# EAGLE design untitled (EAGLE 9.6.2)
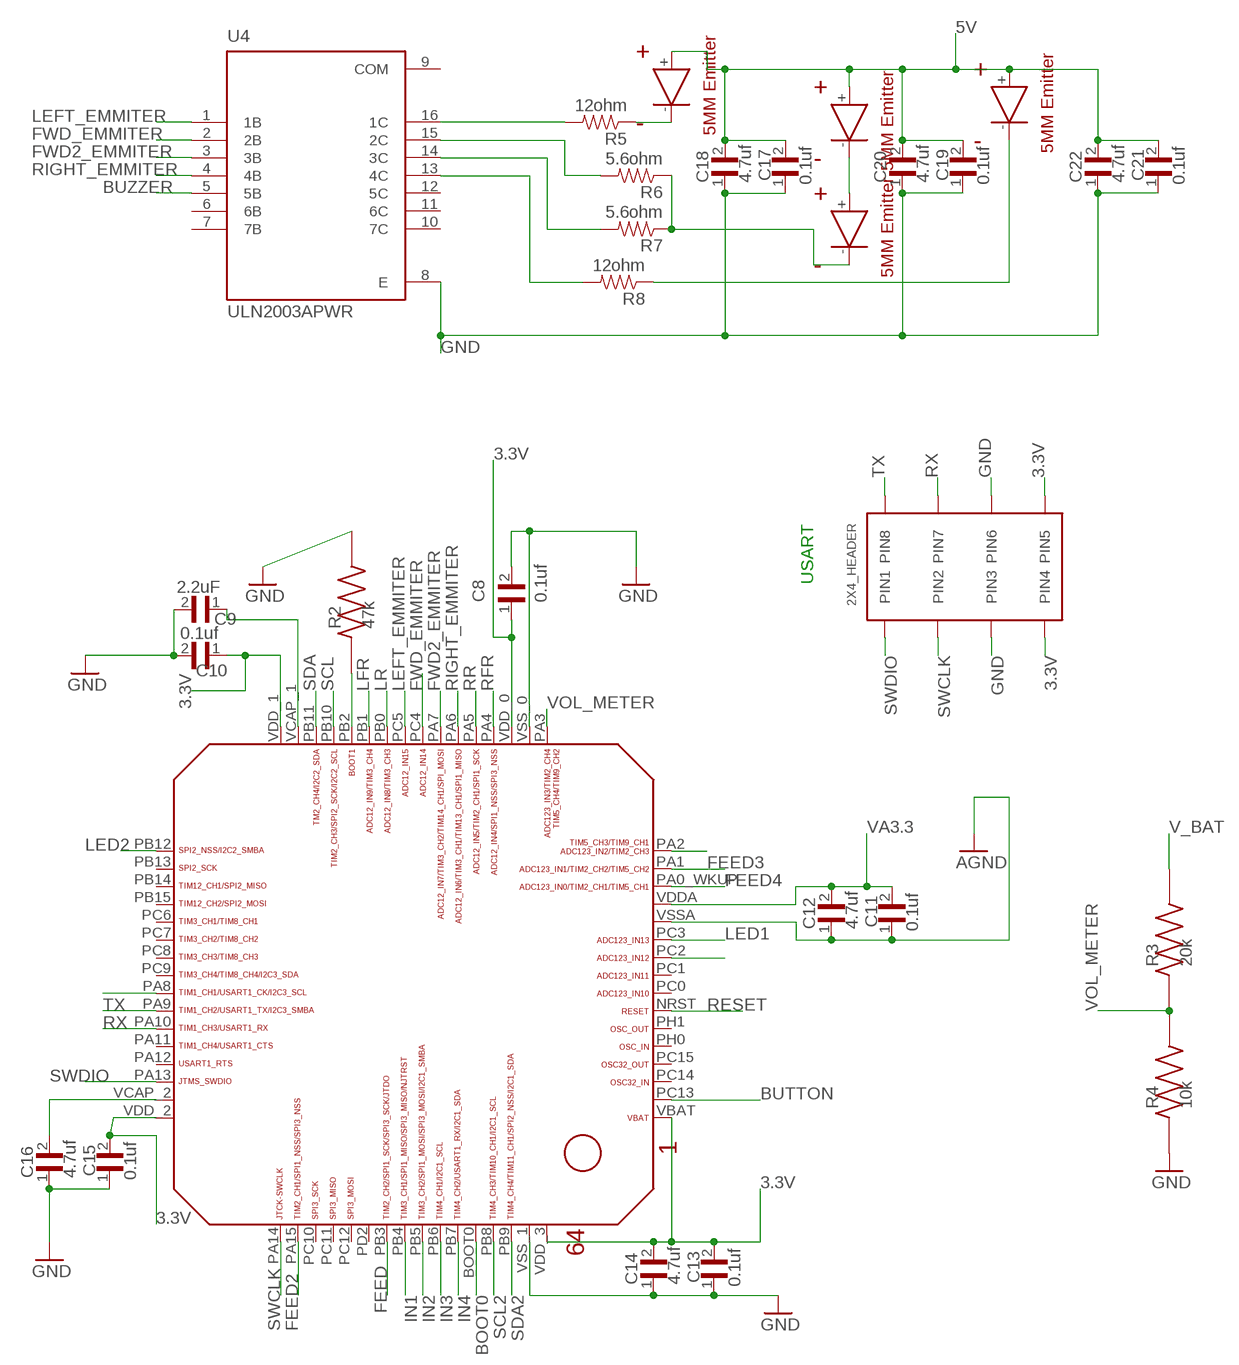
[diagram p0: schematic, sheet 1, part 1 of 2]
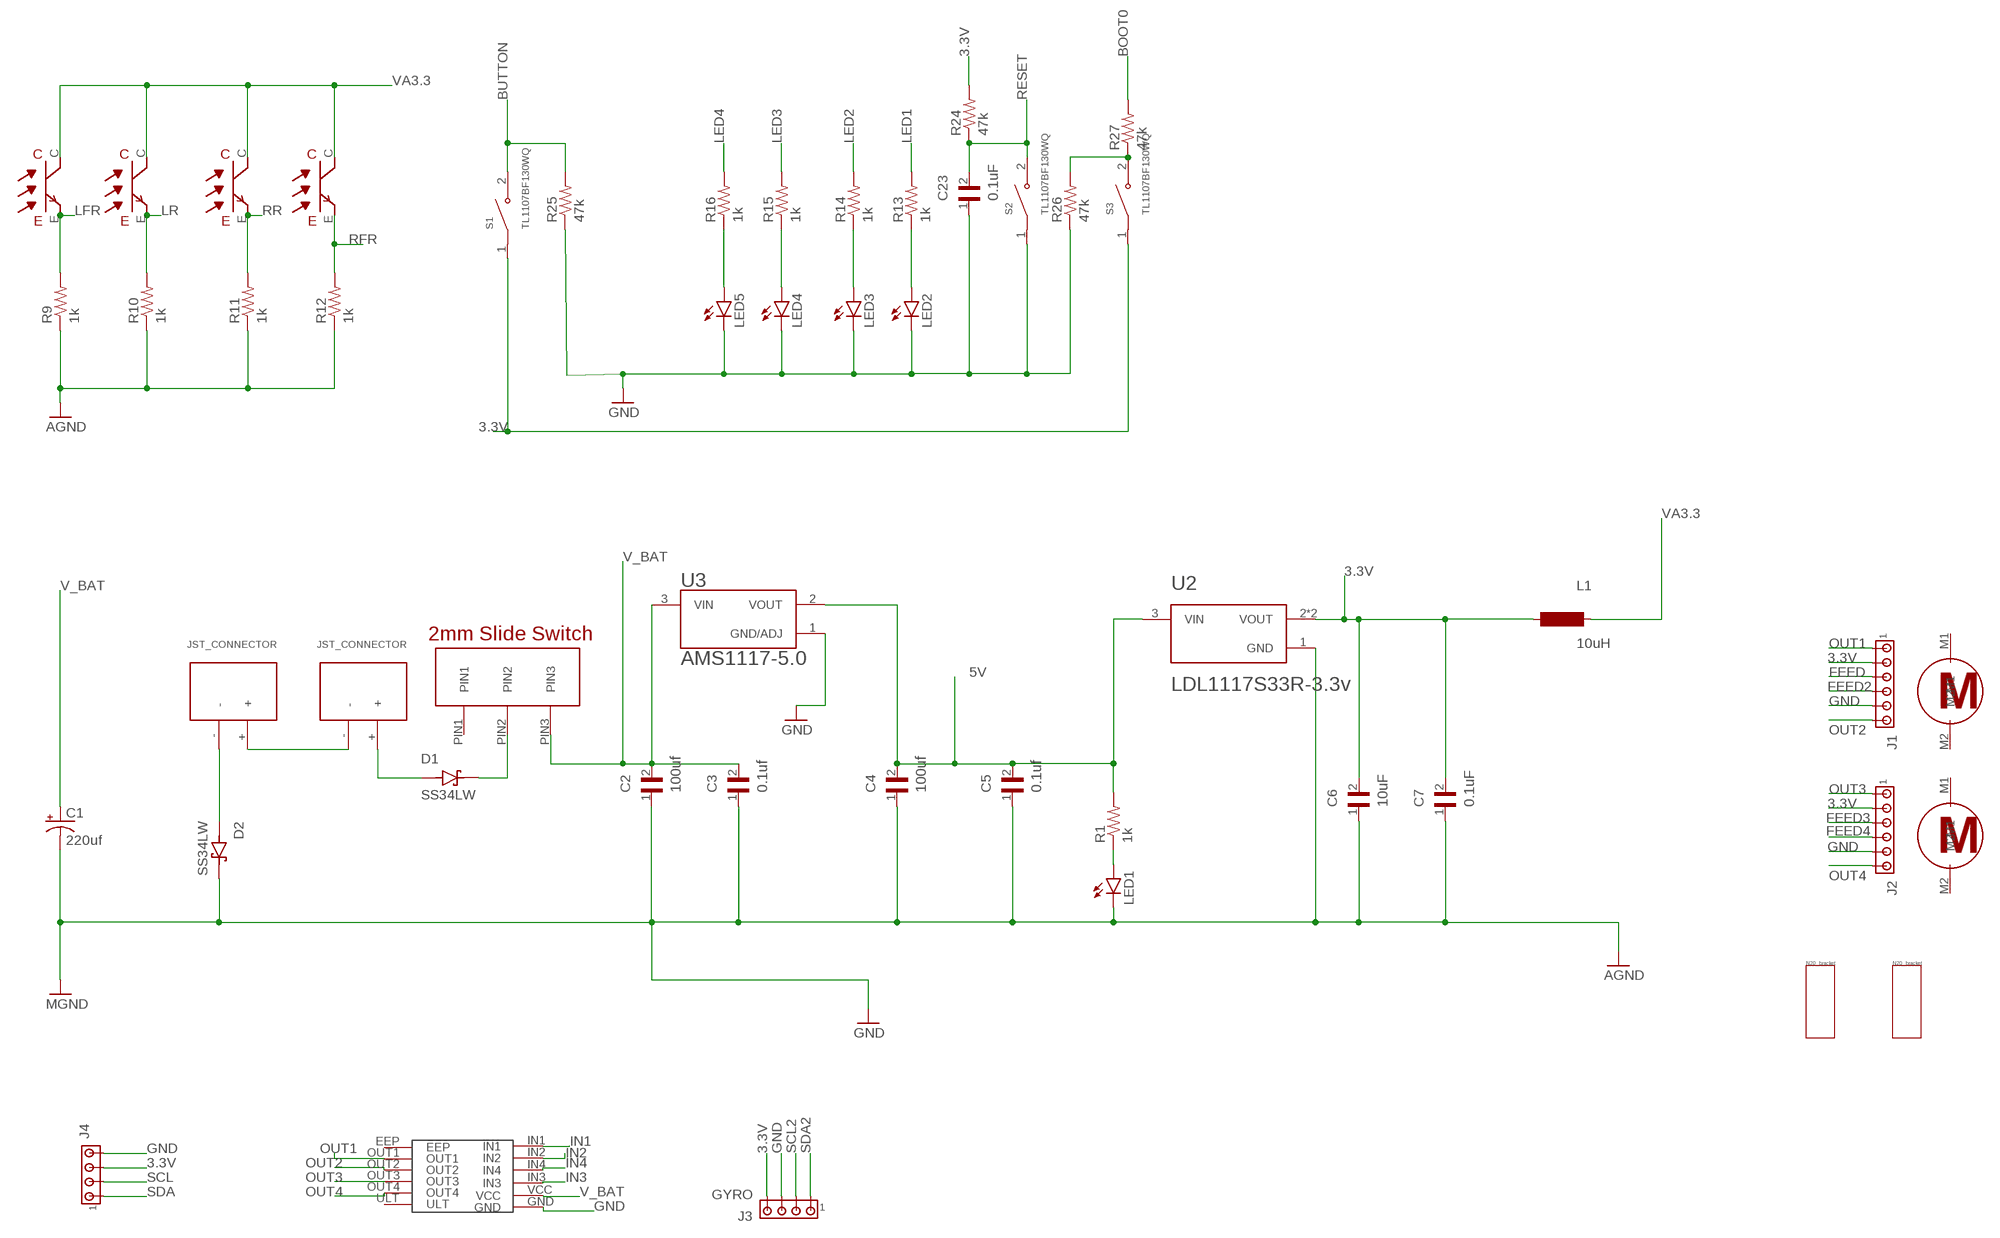
[diagram p1: schematic, sheet 1, part 2 of 2]

## Parts
C1  220uf  CAP_POL1206  [EIA3216]
C2  100uf  GRM033R60J105MEA2D  [CAPC0603X35N]
C3  0.1uf  GRM033R60J105MEA2D  [CAPC0603X35N]
C4  100uf  GRM033R60J105MEA2D  [CAPC0603X35N]
C5  0.1uf  GRM033R60J105MEA2D  [CAPC0603X35N]
C6  10uF  GRM033R60J105MEA2D  [CAPC0603X35N]
C7  0.1uF  GRM033R60J105MEA2D  [CAPC0603X35N]
C8  0.1uf  GRM033R60J105MEA2D  [CAPC0603X35N]
C9  2.2uF  GRM033R60J105MEA2D  [CAPC0603X35N]
C10  0.1uf  GRM033R60J105MEA2D  [CAPC0603X35N]
C11  0.1uf  GRM033R60J105MEA2D  [CAPC0603X35N]
C12  4.7uf  GRM033R60J105MEA2D  [CAPC0603X35N]
C13  0.1uf  GRM033R60J105MEA2D  [CAPC0603X35N]
C14  4.7uf  GRM033R60J105MEA2D  [CAPC0603X35N]
C15  0.1uf  GRM033R60J105MEA2D  [CAPC0603X35N]
C16  4.7uf  GRM033R60J105MEA2D  [CAPC0603X35N]
C17  0.1uf  GRM033R60J105MEA2D  [CAPC0603X35N]
C18  4.7uf  GRM033R60J105MEA2D  [CAPC0603X35N]
C19  0.1uf  GRM033R60J105MEA2D  [CAPC0603X35N]
C20  4.7uf  GRM033R60J105MEA2D  [CAPC0603X35N]
C21  0.1uf  GRM033R60J105MEA2D  [CAPC0603X35N]
C22  4.7uf  GRM033R60J105MEA2D  [CAPC0603X35N]
C23  0.1uF  GRM033R60J105MEA2D  [CAPC0603X35N]
D1  SS34LW  [SODFL3718X102N]
D2  SS34LW  [SODFL3718X102N]
EMMI1  EMITTER  [EMITTER]
J1  MTA06-100  [10X06MTA]
J2  MTA06-100  [10X06MTA]
J3  GYRO  MTA04-100  [10X04MTA]
J4  MTA04-100  [10X04MTA]
L1  10uH  MS42  [MS42]
LED1  LEDCHIPLED_0805  [CHIPLED_0805]
LED2  LEDCHIPLED_0805  [CHIPLED_0805]
LED3  LEDCHIPLED_0805  [CHIPLED_0805]
LED4  LEDCHIPLED_0805  [CHIPLED_0805]
LED5  LEDCHIPLED_0805  [CHIPLED_0805]
R1  1k  RESISTOR0603-RES  [0603-RES]
R2  47k  ERJU01F3570C  [RES_ERJU01F3570C]
R3  20k  ERJU01F3570C  [RES_ERJU01F3570C]
R4  10k  ERJU01F3570C  [RES_ERJU01F3570C]
R5  12ohm  RESISTOR0603-RES  [0603-RES]
R6  5.6ohm  RESISTOR0603-RES  [0603-RES]
R7  5.6ohm  RESISTOR0603-RES  [0603-RES]
R8  12ohm  RESISTOR0603-RES  [0603-RES]
R9  1k  RESISTOR0603-RES  [0603-RES]
R10  1k  RESISTOR0603-RES  [0603-RES]
R11  1k  RESISTOR0603-RES  [0603-RES]
R12  1k  RESISTOR0603-RES  [0603-RES]
R13  1k  RESISTOR0603-RES  [0603-RES]
R14  1k  RESISTOR0603-RES  [0603-RES]
R15  1k  RESISTOR0603-RES  [0603-RES]
R16  1k  RESISTOR0603-RES  [0603-RES]
R24  47k  RESISTOR0603-RES  [0603-RES]
R25  47k  RESISTOR0603-RES  [0603-RES]
R26  47k  RESISTOR0603-RES  [0603-RES]
R27  47k  RESISTOR0603-RES  [0603-RES]
S1  TL1107BF130WQ  [SW_TL1107BF130WQ]
S2  TL1107BF130WQ  [SW_TL1107BF130WQ]
S3  TL1107BF130WQ  [SW_TL1107BF130WQ]
STM32F405RGT6  STM32F405/415_LQFP64  [STM32F405/415_LQFP64]
U2  LDL1117S33R-3.3v  LDL1117S33R  [SOT230P700X180-4N]
U3  AMS1117-5.0  [SOT229P700X180-4N]
U4  ULN2003APWR  [SOP65P640X120-16N]
U$1  N20_BRACKET  [BRACKER]
U$2  MOTOR_N20  [MOTOR_N20]
U$3  MOTOR_N20  [MOTOR_N20]
U$4  N20_BRACKET  [BRACKER]
U$5  JST_CONNECTOR_FEMALE  [JST_CONNECTOR_FEMALE]
U$6  JST_CONNECTOR_FEMALE  [JST_CONNECTOR_FEMALE]
U$8  2MMS_SLIDE_SWITCH  [2MMS_SLIDE_SWITCH]
U$10  2X3_HEADER  [2X3_HEADER]
U$11  DRV8833  [DRV8833]
U$12  RECEIVER  [RECEIVER]
U$13  EMITTER  [EMITTER]
U$14  EMITTER  [EMITTER]
U$15  EMITTER  [EMITTER]
U$16  RECEIVER  [RECEIVER]
U$17  RECEIVER  [RECEIVER]
U$18  RECEIVER  [RECEIVER]

## Nets
3.3V: C6.2 C7.2 C8.1 C10.1 C13.2 C14.2 C15.2 J1.2 J2.2 J3.4 J4.3 L1.1 R24.2 S1.1 S3.1 STM32F405RGT6.VBAT STM32F405RGT6.VDD_0 STM32F405RGT6.VDD_1 STM32F405RGT6.VDD_2 STM32F405RGT6.VDD_3 U2.2(VOUT) U2.4(VOUT) U$10.PIN4 U$10.PIN5
5V: C4.2 C5.2 C17.2 C18.2 C19.2 C20.2 C21.2 C22.2 EMMI1.+ R1.2 U2.3(VIN) U3.2(VOUT) U$13.+ U$15.+
BOOT0: R27.2 STM32F405RGT6.BOOT0
BUTTON: R25.2 S1.2 STM32F405RGT6.PC13
BUZZER: U4.5(5B)
FEED: J1.3 STM32F405RGT6.PB3
FEED2: J1.4 STM32F405RGT6.PA15
FEED3: J2.3 STM32F405RGT6.PA1
FEED4: J2.4 STM32F405RGT6.PA0_WKUP(PA0_AKUP)
FWD2_EMMITER: STM32F405RGT6.PA7 U4.3(3B)
FWD_EMMITER: STM32F405RGT6.PC4 U4.2(2B)
GND: C1.C(-) C2.1 C3.1 C4.1 C5.1 C6.1 C7.1 C8.2 C9.2 C10.2 C11.1 C12.1 C13.1 C14.1 C15.1 C16.1 C17.1 C18.1 C19.1 C20.1 C21.1 C22.1 C23.1 D2.C(K) J1.5 J2.5 J3.3 J4.4 LED1.C LED2.C LED3.C LED4.C LED5.C R2.2 R4.1 R9.1 R10.1 R11.1 R12.1 R25.1 R26.1 S2.1 STM32F405RGT6.VSS_0 STM32F405RGT6.VSS_1 STM32F405RGT6.VSSA U2.1(GND) U3.1(GND/ADJ) U4.8(E) U$10.PIN3 U$10.PIN6 U$11.GND ; supply symbol labelled AGND, MGND
IN1: STM32F405RGT6.PB4 U$11.IN1
IN2: STM32F405RGT6.PB5 U$11.IN2
IN3: STM32F405RGT6.PB6 U$11.IN3
IN4: STM32F405RGT6.PB7 U$11.IN4
LED1: R13.2 STM32F405RGT6.PC3
LED2: R14.2 STM32F405RGT6.PB12
LED3: R15.2 STM32F405RGT6.PC2
LED4: R16.2 STM32F405RGT6.PA8
LEFT_EMMITER: STM32F405RGT6.PC5 U4.1(1B)
LFR: R9.2 STM32F405RGT6.PB1 U$18.E
LR: R10.2 STM32F405RGT6.PB0 U$17.E
N$1: U$13.- U$14.+
N$2: U$5.+ U$6.-
N$3: R2.1 STM32F405RGT6.PB2
N$4: D1.C(K) U$8.PIN2
N$5: R7.2 U4.14(3C)
N$6: C9.1 STM32F405RGT6.VCAP_1
N$7: LED1.A R1.1
N$8: C16.2 STM32F405RGT6.VCAP_2
N$9: LED2.A R13.1
N$10: STM32F405RGT6.PA2
N$11: D1.A U$6.+
N$12: EMMI1.- R5.1
N$13: R5.2 U4.16(1C)
N$14: D2.A U$5.-
N$15: LED3.A R14.1
N$16: R6.2 U4.15(2C)
N$17: R6.1 R7.1 U$14.-
N$18: R8.2 U4.13(4C)
N$19: R8.1 U$15.-
N$22: LED4.A R15.1
N$24: R26.2 R27.1 S3.2
N$25: LED5.A R16.1
OUT1: J1.1 U$11.OUT1
OUT2: J1.6 U$11.OUT2
OUT3: J2.1 U$11.OUT3
OUT4: J2.6 U$11.OUT4
RESET: C23.2 R24.1 S2.2 STM32F405RGT6.NRST
RFR: R12.2 STM32F405RGT6.PA4 U$12.E
RIGHT_EMMITER: STM32F405RGT6.PA6 U4.4(4B)
RR: R11.2 STM32F405RGT6.PA5 U$16.E
RX: STM32F405RGT6.PA10 U$10.PIN7
SCL: J4.2 STM32F405RGT6.PB10
SCL2: J3.2 STM32F405RGT6.PB8
SDA: J4.1 STM32F405RGT6.PB11
SDA2: J3.1 STM32F405RGT6.PB9
SWCLK: STM32F405RGT6.PA14 U$10.PIN2
SWDIO: STM32F405RGT6.PA13 U$10.PIN1
TX: STM32F405RGT6.PA9 U$10.PIN8
V_BAT: C1.A(+) C2.2 C3.2 R3.2 U3.3(VIN) U$8.PIN3 U$11.VCC
VA3.3: C11.2 C12.2 L1.2 STM32F405RGT6.VDDA U$12.C U$16.C U$17.C U$18.C
VOL_METER: R3.1 R4.2 STM32F405RGT6.PA3
Unconnected: STM32F405RGT6.PA11 STM32F405RGT6.PA12 STM32F405RGT6.PB13 STM32F405RGT6.PB14 STM32F405RGT6.PB15 STM32F405RGT6.PC0 STM32F405RGT6.PC1 STM32F405RGT6.PC6 STM32F405RGT6.PC7 STM32F405RGT6.PC8 STM32F405RGT6.PC9 STM32F405RGT6.PC10 STM32F405RGT6.PC11 STM32F405RGT6.PC12 STM32F405RGT6.PC14 STM32F405RGT6.PC15 STM32F405RGT6.PD2 STM32F405RGT6.PH0 STM32F405RGT6.PH1 U4.6(6B) U4.7(7B) U4.10(7C) U4.11(6C) U4.12(5C) U$2.M1 U$2.M2 U$3.M1 U$3.M2 U$8.PIN1 U$11.EEP U$11.ULT

## Notes on the sheet
- USART

## Power pins joined to a net without a drawn wire
COM: U4.9(COM)

## Library data of the parts
C1 = SparkFun:CAP_POL: Capacitor Polarized These are standard SMD and PTH capacitors. Normally 10uF, 47uF, and 100uF in electrolytic and tantalum varieties. Always verify the external diameter of the through hole cap, it varies with capacity, voltage, and manufacturer. The EIA devices should be standard.
C2-C23 = SMD CAP:GRM033R60J105MEA2D: SMD Capacitor X5R(EIA) with Capacitance: 1.0uF Tol. 20%. Rated Voltage: 6.3Vdc Check availability <https://pricing.snapeda.com/parts/GRM033R60J105MEA2D/Murata/view-part?ref=eda>; AVAILABILITY: In Stock; CHECK_PRICES: https://www.snapeda.com/parts/GRM033R60J105MEA2D/Murata+Electronics+North+America/view-part/?ref=eda; DESCRIPTION: SMD capacitor X5R(EIA) with capacitance 1.0uF Tol.20%. Rated voltage 6.3Vdc 85C; MF: Murata; MP: GRM033R60J105MEA2D; PACKAGE: 0603 Taiyo Yuden; PRICE: None; SNAPEDA_LINK: https://www.snapeda.com/parts/GRM033R60J105MEA2D/Murata+Electronics+North+America/view-part/?ref=snap
D1 D2 = SS34LW:SS34LW: Check availability <https://pricing.snapeda.com/parts/SS34LW/Taiwan%20Semiconductor/view-part?ref=eda>; AVAILABILITY: In Stock; CHECK_PRICES: https://www.snapeda.com/parts/SS34LW/Taiwan+Semiconductor/view-part/?ref=eda; DESCRIPTION: 3A, 40V, Schottky Rectifier; MF: Taiwan Semiconductor; MP: SS34LW; PACKAGE: SOD-123W-2 Taiwan Semiconductor; PRICE: None; PURCHASE-URL: https://www.snapeda.com/api/url_track_click_mouser/?unipart_id=4812745&manufacturer=Taiwan Semiconductor&part_name=SS34LW&search_term=ss34; SNAPEDA_LINK: https://www.snapeda.com/parts/SS34LW/Taiwan+Semiconductor/view-part/?ref=snap
EMMI1 U$13-U$15 = sfh4550 & teft4300:EMITTER
J1 J2 = con-amp:MTA06-100: AMP connector Connection corrected 2014-09-19
J3 J4 = con-amp:MTA04-100: AMP connector
L1 = inductor-neosid:MS42: INDUCTOR SMD inductor; OC_FARNELL: unknown; OC_NEWARK: unknown
LED1-LED5 = led:LED: LED OSRAM: - CHIPLED LG R971, LG N971, LY N971, LG Q971, LY Q971, LO R971, LY R971 LH N974, LH R974 LS Q976, LO Q976, LY Q976 LO Q996 - Hyper CHIPLED LW Q18S LB Q993, LB Q99A, LB R99A - SideLED LS A670, LO A670, LY A670, LG A670, LP A670 LB A673, LV A673, LT A673, LW A673 LH A674 LY A675 LS A676, LA A676, LO A676, LY A676, LW A676 LS A679, LY A679, LG A679 - Hyper Micro SIDELED® LS Y876, LA Y876, LO Y876, LY Y876 LT Y87S - SmartLED LW L88C, LW L88S LB L89C, LB L89S, LG L890 LS L89K, LO L89K, LY L89K LS L896, LA L896, LO L896, LY L896 - TOPLED LS T670, LO T670, LY T670, LG T670, LP T670 LSG T670, LSP T670, LSY T670, LOP T670, LYG T670 LG T671, LOG T671, LSG T671 LB T673, LV T673, LT T673, LW T673 LH T674 LS T676, LA T676, LO T676, LY T676, LB T676, LH T676, LSB T676, LW T676 LB T67C, LV T67C, LT T67C, LS T67K, LO T67K, LY T67K, LW E67C LS E67B, LA E67B, LO E67B, LY E67B, LB E67C, LV E67C, LT E67C LW T67C LS T679, LY T679, LG T679 LS T770, LO T770, LY T770, LG T770, LP T770 LB T773, LV T773, LT T773, LW T773 LH T774 LS E675, LA E675, LY E675, LS T675 LS T776, LA T776, LO T776, LY T776, LB T776 LHGB T686 LT T68C, LB T68C - Hyper Mini TOPLED® LB M676 - Mini TOPLED Santana® LG M470 LS M47K, LO M47K, LY M47K Source: http://www.osram.convergy.de LUXEON: - LUMILED® LXK2-PW12-R00, LXK2-PW12-S00, LXK2-PW14-U00, LXK2-PW14-V00 LXK2-PM12-R00, LXK2-PM12-S00, LXK2-PM14-U00 LXK2-PE12-Q00, LXK2-PE12-R00, LXK2-PE12-S00, LXK2-PE14-T00, LXK2-PE14-U00 LXK2-PB12-K00, LXK2-PB12-L00, LXK2-PB12-M00, LXK2-PB14-N00, LXK2-PB14-P00, LXK2-PB14-Q00 LXK2-PR12-L00, LXK2-PR12-M00, LXK2-PR14-Q00, LXK2-PR14-R00 LXK2-PD12-Q00, LXK2-PD12-R00, LXK2-PD12-S00 LXK2-PH12-R00, LXK2-PH12-S00 LXK2-PL12-P00, LXK2-PL12-Q00, LXK2-PL12-R00 Source: www.luxeon.com KINGBRIGHT: KA-3528ASYC Source: www.kingbright.com
R1 R5-R16 R24-R27 = SparkFun:RESISTOR: Resistor Basic schematic elements and footprints for 0603, 1206, and PTH resistors.
R2-R4 = resistor:ERJU01F3570C: Check availability <https://pricing.snapeda.com/parts/ERJ-U01F3570C/Panasonic/view-part?ref=eda>; AVAILABILITY: In Stock; CHECK_PRICES: https://www.snapeda.com/parts/ERJ-U01F3570C/Panasonic/view-part/?ref=eda; DESCRIPTION: 0201 anti-sulfurated resistor 0201 Anti-Sulfurated; MF: Panasonic; MP: ERJ-U01F3570C; PACKAGE: 0603-2 Panasonic; PRICE: None; SNAPEDA_LINK: https://www.snapeda.com/parts/ERJ-U01F3570C/Panasonic/view-part/?ref=snap
S1-S3 = tactical switch:TL1107BF130WQ: Check availability <https://pricing.snapeda.com/parts/TL1107BF130WQ/E-Switch/view-part?ref=eda>; AVAILABILITY: In Stock; CHECK_PRICES: https://www.snapeda.com/parts/TL1107BF130WQ/E-Switch/view-part/?ref=eda; DESCRIPTION: SWITCH TACTILE SPST-NO 0.05A 12V; MF: E-Switch; MP: TL1107BF130WQ; PACKAGE: None; PRICE: None; PURCHASE-URL: https://www.snapeda.com/api/url_track_click_mouser/?unipart_id=5002039&manufacturer=E-Switch&part_name=TL1107BF130WQ&search_term=switch tactical; SNAPEDA_LINK: https://www.snapeda.com/parts/TL1107BF130WQ/E-Switch/view-part/?ref=snap
STM32F405RGT6 = STM32F10x F4xx:STM32F405/415_LQFP64
U2 = LDL1117S33R:LDL1117S33R: Check availability <https://pricing.snapeda.com/parts/LDL1117S33R/STMicroelectronics/view-part?ref=eda>; AVAILABILITY: In Stock; CHECK_PRICES: https://www.snapeda.com/parts/LDL1117S33R/STMicroelectronics/view-part/?ref=eda; DESCRIPTION: Linear Voltage Regulator IC Positive Fixed 1 Output 1.2A SOT-223; MF: STMicroelectronics; MP: LDL1117S33R; PACKAGE: SOT-223 STMicroelectronics; PRICE: None; PURCHASE-URL: https://www.snapeda.com/api/url_track_click_mouser/?unipart_id=865632&manufacturer=STMicroelectronics&part_name=LDL1117S33R&search_term=ldl1117s33r; SNAPEDA_LINK: https://www.snapeda.com/parts/LDL1117S33R/STMicroelectronics/view-part/?ref=snap
U3 = AMS1117-5.0:AMS1117-5.0: Check availability <https://pricing.snapeda.com/parts/AMS1117-5.0/Advanced%20Monolithic%20Systems/view-part?ref=eda>; AVAILABILITY: Not in stock; CHECK_PRICES: https://www.snapeda.com/parts/AMS1117-5.0/Advanced+Monolithic+Systems/view-part/?ref=eda; DESCRIPTION: Sot223/Pkg 1-Amp 5-Volt Low Drop Out Voltage Regulatator; MF: Advanced Monolithic Systems; MP: AMS1117-5.0; PACKAGE: SOT-223 Seeed Technology; PRICE: None; SNAPEDA_LINK: https://www.snapeda.com/parts/AMS1117-5.0/Advanced+Monolithic+Systems/view-part/?ref=snap
U4 = ULN2003APWR:ULN2003APWR: 50-V, 7-ch darlington transistor array, -20C to 70C 16-TSSOP -40 to 70 Check availability <https://pricing.snapeda.com/parts/ULN2003APWR/Texas%20Instruments/view-part?ref=eda>; AVAILABILITY: In Stock; CHECK_PRICES: https://www.snapeda.com/parts/ULN2003APWR/Texas+Instruments/view-part/?ref=eda; DESCRIPTION: 50-V, 7-ch darlington transistor array, -20C to 70C; MF: Texas Instruments; MP: ULN2003APWR; PACKAGE: TSSOP-16 Texas Instruments; PRICE: None; SNAPEDA_LINK: https://www.snapeda.com/parts/ULN2003APWR/Texas+Instruments/view-part/?ref=snap
U$1 U$4 = Motor N20:N20_BRACKET
U$2 U$3 = Motor N20:MOTOR_N20
U$5 U$6 = JST_CONNECTOR_FEMALE. through hole:JST_CONNECTOR_FEMALE
U$8 = 2MMS_SLIDE_SWITCH:2MMS_SLIDE_SWITCH
U$10 = 2X4_HEADER:2X3_HEADER
U$11 = drv8833:DRV8833
U$12 U$16-U$18 = sfh4550 & teft4300:RECEIVER

## Board
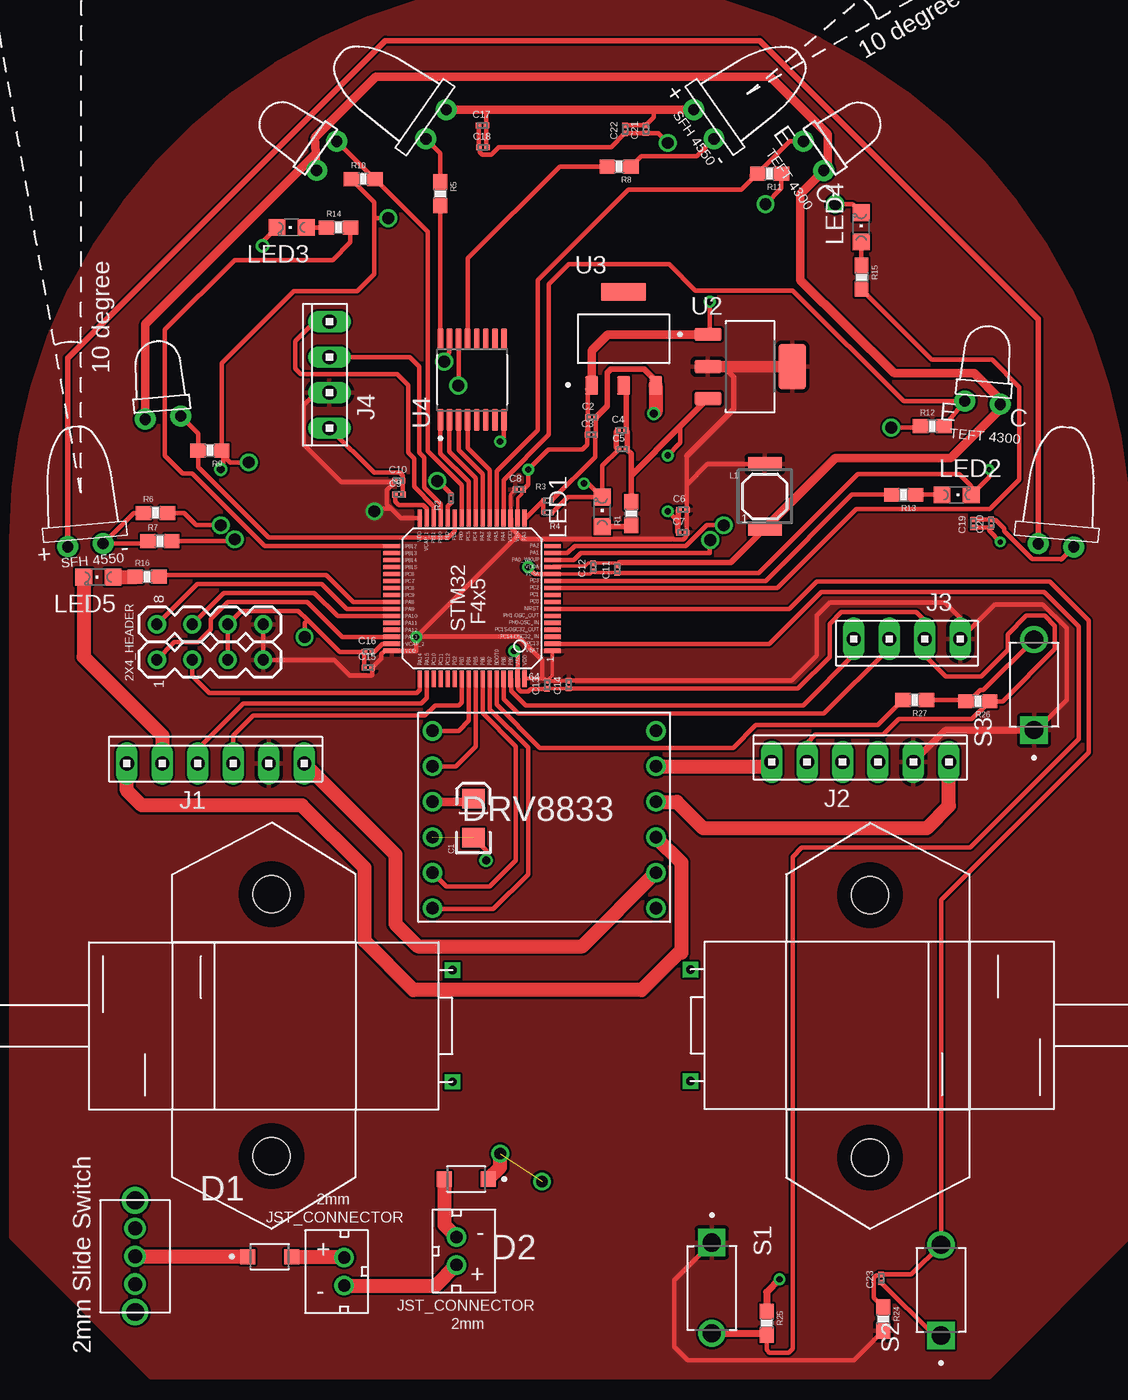
[diagram p2: board, top side]
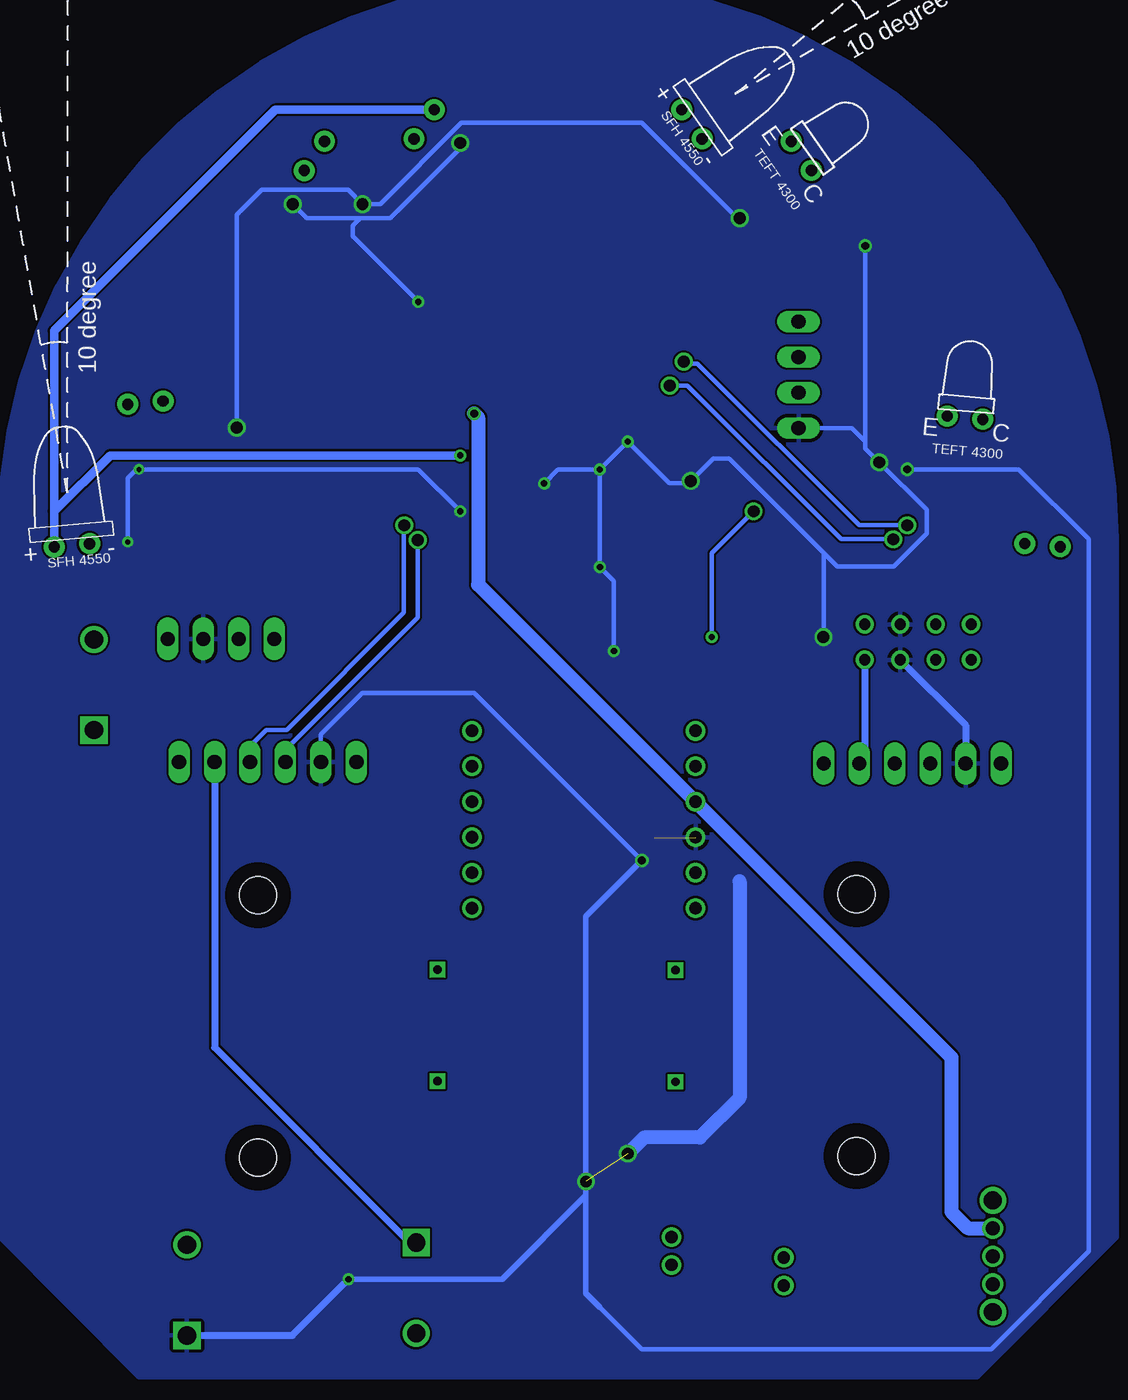
[diagram p3: board, bottom side, seen from below]

No outline drawn. Coordinates in mm, seen from the top.
Copper layers (1*16): Top 0.035mm / dielectric 1.5mm / Bottom 0.035mm
Design rules "default *": minimum track width 6mil, minimum drill 0.35mm, track to track 6mil, track to pad 6mil, pad to pad 6mil, via to via 6mil, smd to smd 6mil, copper to edge 40mil, drill to drill 6mil, minimum pad ring 10mil, minimum via ring 8mil, stop-mask expansion 4mil, vias tented up to drill 0mil, thermal gap 10mil

### Footprints (pad centres in the part's own frame; a part is rotated, then mirrored left to right if it is on the bottom)
EIA3216 = smd 1.4 x 1.6: A 1.4,0; C -1.4,0
CAPC0603X35N = smd 0.38 x 0.4: 1 -0.28,0; 2 0.28,0
SODFL3718X102N = smd 1.08 x 1.09: A 1.575,0; C -1.575,0
EMITTER = drill 0.8 pad 1.5: + -1.27,-0.5; - 1.27,-0.5
10X06MTA = drill 1.016 long: 1 6.35,0; 2 3.81,0; 3 1.27,0; 4 -1.27,0; 5 -3.81,0; 6 -6.35,0
10X04MTA = drill 1.016 long: 1 3.81,0; 2 1.27,0; 3 -1.27,0; 4 -3.81,0
MS42 = smd 2.4 x 1: 1 0,2.3; 2 0,-2.3
CHIPLED_0805 = smd 1.2 x 1.2: A 0,-1.05; C 0,1.05
0603-RES = smd 1.1 x 1: 1 -0.85,0; 2 0.85,0
RES_ERJU01F3570C = smd 0.25 x 0.3: 1 -0.3,0; 2 0.3,0
SW_TL1107BF130WQ = drill 1.3 square: 1 -3.25,0 | drill 1.3: 2 3.25,0
STM32F405/415_LQFP64 = smd 1.2 x 0.3: BOOT0 -5.75,-1.75; PA3 5.75,-3.75; PA4 5.75,-2.25; PA5 5.75,-1.75; PA6 5.75,-1.25; PA7 5.75,-0.75; PA14 -5.75,3.75; PA15 -5.75,3.25; PB0 5.75,0.75; PB1 5.75,1.25; PB2 5.75,1.75; PB3 -5.75,0.75; PB4 -5.75,0.25; PB5 -5.75,-0.25; PB6 -5.75,-0.75; PB7 -5.75,-1.25; PB8 -5.75,-2.25; PB9 -5.75,-2.75; PB10 5.75,2.25; PB11 5.75,2.75; PC4 5.75,-0.25; PC5 5.75,0.25; PC10 -5.75,2.75; PC11 -5.75,2.25; PC12 -5.75,1.75; PD2 -5.75,1.25; VCAP_1 5.75,3.25; VDD_0 5.75,-2.75; VDD_1 5.75,3.75; VDD_3 -5.75,-3.75; VSS_0 5.75,-3.25; VSS_1 -5.75,-3.25 | smd 0.3 x 1.2: NRST -0.75,-5.75; PA0_WKUP 2.75,-5.75; PA1 3.25,-5.75; PA2 3.75,-5.75; PA8 -0.25,5.75; PA9 -0.75,5.75; PA10 -1.25,5.75; PA11 -1.75,5.75; PA12 -2.25,5.75; PA13 -2.75,5.75; PB12 3.75,5.75; PB13 3.25,5.75; PB14 2.75,5.75; PB15 2.25,5.75; PC0 -0.25,-5.75; PC1 0.25,-5.75; PC2 0.75,-5.75; PC3 1.25,-5.75; PC6 1.75,5.75; PC7 1.25,5.75; PC8 0.75,5.75; PC9 0.25,5.75; PC13 -3.25,-5.75; PC14 -2.75,-5.75; PC15 -2.25,-5.75; PH0 -1.75,-5.75; PH1 -1.25,-5.75; VBAT -3.75,-5.75; VCAP_2 -3.25,5.75; VDD_2 -3.75,5.75; VDDA 2.25,-5.75; VSSA 1.75,-5.75
SOT230P700X180-4N = smd 1.98 x 0.93: 1 -3.015,2.3; 2 -3.015,0; 3 -3.015,-2.3 | smd 1.98 x 3.23: 4 3.015,0
SOT229P700X180-4N = smd 0.93 x 1.31: 1 -2.29,-3.345; 2 0,-3.345; 3 2.29,-3.345 | smd 3.24 x 1.31: 4 0,3.345
SOP65P640X120-16N = smd 1.57 x 0.41: 1 -2.87,2.275; 2 -2.87,1.625; 3 -2.87,0.975; 4 -2.87,0.325; 5 -2.87,-0.325; 6 -2.87,-0.975; 7 -2.87,-1.625; 8 -2.87,-2.275; 9 2.87,-2.275; 10 2.87,-1.625; 11 2.87,-0.975; 12 2.87,-0.325; 13 2.87,0.325; 14 2.87,0.975; 15 2.87,1.625; 16 2.87,2.275
BRACKER = hole 2.66: -3.43,7.1; 15.35,7.1
MOTOR_N20 = drill 0.6 square: M1 2,-1; M2 10,-1
JST_CONNECTOR_FEMALE = drill 0.889: + 0,1; - 0,-1
2MMS_SLIDE_SWITCH = drill 1.27 pad 1.905: P$4 -4,0; P$5 4,0 | drill 1 pad 1.524: PIN1 -2,0; PIN2 0,0; PIN3 2,0
2X3_HEADER = drill 0.8: PIN1 -1.27,3.81; PIN2 -1.27,1.27; PIN3 -1.27,-1.27; PIN4 -1.27,-3.81; PIN5 1.27,-3.81; PIN6 1.27,-1.27; PIN7 1.27,1.27; PIN8 1.27,3.81
DRV8833 = drill 0.9 pad 1.422: EEP 1,14; GND 17,8.92; IN1 17,1.3; IN2 17,3.84; IN3 17,11.46; IN4 17,14; OUT1 1,11.46; OUT2 1,8.92; OUT3 1,6.38; OUT4 1,3.84; ULT 1,1.3; VCC 17,6.38
RECEIVER = drill 0.8 pad 1.5: C 1.27,-0.5; E -1.27,-0.5

### Placement (x,y rotation side)
C1  43.09,40.02 90 top
C2  51.57,68.72 0 top
C3  51.52,67.47 0 top
C4  53.71,67.79 0 top
C5  53.76,66.43 0 top
C6  58.09,62.1 0 top
C7  58.07,60.47 0 top
C8  46.37,63.56 0 top
C9  37.76,63.2 0 top
C10  37.74,64.19 0 top
C11  53.38,57.86 90 top
C12  51.65,58 90 top
C13  48.35,49.56 90 top
C14  49.9,49.59 90 top
C15  35.56,50.8 0 top
C16  35.56,51.93 0 top
C17  43.74,89.62 0 top
C18  43.77,88.05 0 top
C19  78.87,61.12 90 top
C20  80.15,61.14 90 top
C21  55.43,89.35 90 top
C22  53.94,89.34 90 top
C23  72.26,7.07 90 top
D1  28.5,8.62 0 top
D2  42.58,14.18 180 top
EMMI1  40.01,90 305 bottom
J1  24.63,43.94 0 top
J2  70.78,44.05 0 top
J3  74.13,52.86 180 top
J4  32.78,71.78 90 top
L1  63.95,63.07 0 top
LED1  52.31,61.96 0 top
LED2  77.68,63.17 270 top
LED3  30.07,82.33 90 top
LED4  70.85,82.34 0 top
LED5  16.24,57.29 90 top
R1  54.38,61.84 90 top
R2  41.51,62.93 90 top
R3  48.41,62.79 0 top
R4  48.4,61.89 180 top
R5  40.71,84.74 270 top
R6  20.33,61.89 0 top
R7  20.64,59.86 0 top
R8  53.52,86.7 180 top
R9  24.22,66.36 180 top
R10  35.2,85.79 0 top
R11  64.29,86.18 179.5 top
R12  75.93,68.09 0 top
R13  73.88,63.18 180 top
R14  33.43,82.32 0 top
R15  70.87,78.76 270 top
R16  19.73,57.31 0 top
R24  72.43,4.15 270 top
R25  64.08,3.86 270 top
R26  79.21,48.4 180 top
R27  74.69,48.48 180 top
S1  60.16,6.37 270 top
S2  76.57,6.23 90 top
S3  83.22,49.58 90 top
STM32F405RGT6  43,55.76 90 top
U2  62.9,72.37 0 top
U3  53.84,74.35 0 top
U4  43,71.43 90 top
U$1  21.54,31.16 270 top
U$2  40.58,19.14 90 top
U$3  59.64,31.19 270 top
U$4  78.59,19.15 90 top
U$5  41.87,9.03 180 top
U$6  33.84,7.55 0 top
U$8  18.87,8.65 90 top
U$10  24.24,52.64 90 top
U$11  57.16,47.58 180 top
U$12  79.58,70.27 355 top
U$13  84.84,60.06 5 bottom
U$14  15.27,60.07 5 top
U$15  59.99,90 305 top
U$16  67.85,87.74 305 top
U$17  32.18,87.74 305 bottom
U$18  20.82,69.2 355 bottom

### Tracks (layer width: path | path; a pad name or v marks a point on that pad's centre or on a via)
3.3V  (via drill 0.45, 0.85)
  Top 0.254: C8.1 45.75,63.22 STM32F405RGT6.VDD_0 | STM32F405RGT6.VDD_3 48,50.01 48.19,50.01 C13.2 | C13.2 49.88,49.84 C14.2 | STM32F405RGT6.VBAT 48.75,50.24 C13.2
  Top 0.305: STM32F405RGT6.VDD_1 37.88,61.51 37.19,62.19 | 37.19,62.19 36.89,62.5 36.89,63.51 37.35,63.97 37.3,64.02 | 37.3,64.02 C10.1 | U$10.PIN5 U$10.PIN4 33.12,51.37 34.25,50.24 35.79,50.24 35.84,50.29 C15.2 36.51,51.47 36.51,51.78 36.74,52.01 STM32F405RGT6.VDD_2 39,52.01 v39,53 | R24.2 70.33,1.2 58.45,1.2 57.46,2.18 57.46,6.93 S1.1 | 37.3,64.02 37.22,64.1 33.64,64.1 30.95,66.78 30.95,69.61 31.85,70.51 J4.3 | v39,53 39.02,53.02 46.29,53.02 48,51.31 48,50.01 | C14.2 65.87,49.87 67.67,51.67 67.67,54.55 68.59,55.47 76.83,55.47 77.94,54.37 J3.4 80.41,55.34 83.85,55.34 85.56,53.63 85.56,48.47 83.41,46.33 82.96,46.33 | STM32F405RGT6.VDD_0 45.79,61.47 45.79,60.78 46.29,60.29 | C7.2 58.3,60.42 58.3,60.16 58.1,59.96 57.47,59.96 57.43,60.01 46.57,60.01 46.29,60.29 | L1.1 59.83,65.37 58.35,63.89 58.37,63.86 | 37.19,62.19 36.19,62.19 v36,62 | v39,53 46.29,60.29 | 58.37,63.86 C6.2 58.37,60.5 | 58.37,63.86 58.37,65.94
  Top 0.406: 58.37,65.94 61.74,69.31 61.74,71.63 60.99,72.37 U2.2 | 58.37,60.5 C7.2
  Top 0.508: J2.2 76.87,46.33 82.96,46.33 S3.1
  Top 0.813: U2.2 U2.4
  Bottom 0.305: v36,62 39,59 v39,53
  Bottom 0.508: J2.2 74.59,23.59 60,9 60,9.47 S1.1 | U$10.PIN4 28.05,44.33 J1.2
  pour Top: 10,10 10,60 arc-90 50.01,100.01 50.05,100.01 arc-90 90,60.06 90,60 90,10 80,0 20,0
5V  (via drill 0.45)
  Top 0.305: 44,90.75 44,89.64 C17.2 44.02,88.08 C18.2 | C22.2 53.95,89.63 C21.2 56,90.21 56,90.75 | C19.2 80.13,61.41 C20.2 80.21,61.36 80.47,61.36 81.07,60.76 81.07,60.6 83.08,58.59 85.15,58.59 85.17,58.56 U$13.+ | 57.91,68.09 57.91,66.91 v57,66
  Top 0.406: U3.2 54.03,70.82 54.03,68.43 54.03,67.83 C4.2 54.09,67.68 54.09,66.48 C5.2 54.08,66.43 54.38,66.13 | U2.3 57.91,68.09 54.38,64.57 | R1.2 54.38,64.57 | 54.38,64.57 54.38,66.13 | 54.38,66.13
  Top 0.61: EMMI1.+ 44,90.75 56,90.75 U$15.+
  Bottom 0.61: U$15.+ 70.25,90.75 86.07,74.93 86.07,62 | 86.07,62 U$13.+ | v57,66 82.07,66 86.07,62
BOOT0
  Top 0.305: STM32F405RGT6.BOOT0 44.75,48.15 47.84,45.06 61.67,45.06 63.3,46.69 72.03,46.69 R27.2
BUTTON
  Top 0.305: STM32F405RGT6.PC13 64.26,52.51 67.97,56.22 83.95,56.22 86.44,53.73 86.44,45.7 78.65,37.91 66.61,37.91 65.94,37.25 65.94,2.04 65.65,1.74 64.28,1.74 64.08,1.94 R25.2
  Top 0.508: S1.2 63.96,3.12 R25.2
FEED
  Top 0.305: STM32F405RGT6.PB3 42.24,48.32 42.02,48.1 40.34,48.1 39.61,47.37 27.34,47.37 25.9,45.94 J1.3
FEED2
  Top 0.305: STM32F405RGT6.PA15 39.75,48.63 39.34,48.23 26.61,48.23 23.36,44.98 J1.4
FEED3  (via drill 0.85)
  Top 0.305: STM32F405RGT6.PA1 49.82,59.01 50.33,59.53 57.26,59.53 57.28,59.51 58.29,59.51 59.78,61 v61,61
  Bottom 0.305: J2.3 72.05,45.17 70.88,46.34 69.42,46.34 61.03,54.74 61.03,60.97 v61,61
FEED4  (via drill 0.85)
  Top 0.305: STM32F405RGT6.PA0_WKUP 50.28,58.51 50.77,59 60,59 60,59.88 v60.05,59.93
  Bottom 0.305: v60.05,59.93 60.05,54.38 67.22,47.22 69.51,44.92 J2.4
FWD2_EMMITER
  Top 0.305: U4.3 42.02,66.39 43.75,64.67 STM32F405RGT6.PA7
FWD_EMMITER
  Top 0.305: STM32F405RGT6.PC4 43.25,64.39 41.37,66.27 U4.2
GND  (via drill 0.35, 0.45, 0.55, 0.85)  (2 unrouted)
  Top 0.254: STM32F405RGT6.VSSA 51.45,57.51 C12.1 51.76,57.61 53.34,57.61 C11.1 | C8.2 46.56,63.47 46.56,63.24 46.25,62.93 STM32F405RGT6.VSS_0 | C13.1 48.38,49.31 C14.1
  Top 0.305: C13.1 47.2,49.28 47.02,49.1 46.47,49.1 46.29,49.28 46.29,49.97 STM32F405RGT6.VSS_1 46.25,51.82 46.07,52 v46,52 | C16.1 | C16.1 C15.1 | R4.1 49.82,63.01 LED1.C | C5.1 52.31,65.26 LED1.C | U$10.PIN3 U$10.PIN6 26.47,54.87 30.56,54.87 31.22,54.22 | C16.1 33.51,51.93 31.22,54.22 | C17.1 43.46,88.08 C18.1 43.56,87.98 43.56,87.72 43.73,87.54 44.37,87.54 44.91,88.08 52.96,88.08 C22.1 55.42,89.06 | C21.1 55.42,89.06 | C20.1 80.13,60.84 80,60.84 | 80,60.84 C19.1 | C23.1 76.07,2.98 S2.1 | C9.2 38.02,63.22 C10.2 38.03,64.2 38.03,64.57 37.83,64.78 35.98,64.78 J4.4 | C14.1 66.31,49.31 68.58,51.58 68.58,53.94 69.44,54.8 74.81,54.8 75.41,54.19 75.41,52.88 J3.3 75.4,51.67 76.89,50.18 79.43,50.18 81.33,52.08 81.33,53.19 82.67,54.52 83.98,54.52 84.72,53.78 84.72,52.13 80.98,48.4 R26.1 78.78,47.12 73.55,47.12 72.44,46 67.58,46 66.97,45.4 J2.5 | C11.1 63.51,57.58 70.6,64.67 77.88,64.67 78.73,63.81 LED2.C 80,64.44 v80,65 | v80.8,59.8 80,60.61 80,60.84 | 57.7,61 57.7,61.3 v57,62 | U4.8 45.27,67.27 v45,67 | C8.2 47.02,63.93 v47.02,64.98 48.44,66.4 50.86,66.4 51.24,66.78 C3.1 | v51,64 51.32,64 LED1.C | v60,77 60,74.79 U2.1 | v69,84 70.25,84 LED4.C | R10.1 36,84.15 36,83 | 36,83 36,79 34.77,77.77 30.24,77.77 25.07,72.61 R9.1 25.17,66.26 25.17,66 | R11.1 65.14,85.14 v64,84 | LED3.C 28,81.31 v28,81 | 25.17,66 25.17,65.17 v25,65 | STM32F405RGT6.VSSA 47.49,57.51 v47,58 | v27,65.5 25.67,65.5 25.17,66 | 31.22,54.22 31,54 v31,53 | 36,83 v37,83 | v57,88.38 56.31,89.06 55.42,89.06 | R12.1 75,68 v73,68 | 51.29,70.74 C2.1 51.29,67.85 | C1.C 44,37.71 v44,37 | R2.2 40.56,64.18 v40.5,64.18
  Top 0.406: U3.1 51.29,70.74 | 51.29,67.85 51.26,67.82 51.26,67.48 C3.1 | C4.1 53.31,67.67 53.31,66.61 C5.1 | C6.1 57.77,62.06 57.77,61.07 57.7,61 57.7,60.56 C7.1 | D2.C 44.33,14
  Top 0.508: v65,7 64.08,6.08 R25.1
  Top 0.61: U3.1 51.55,73.51 52.71,74.67 U2.1
  Top 1.016: LED5.C 15.19,51.57 20.82,45.93 J1.5 | D2.C 45,15.03 v45,16
  Bottom 0.305: v80.8,59.8 80.8,64.38 80.18,65 v80,65 60,65 v57,62 | v47.02,64.98 v45,67 42.04,64.04 40.64,64.04 v40.5,64.18 38.89,65.79 37.75,65.79 30.98,59.02 | v47.02,64.98 50.02,64.98 v51,64 | J4.4 28.97,67.97 28,67 | 64.16,83 62,83 57,88 v57,88.38 | 64.16,83 68,83 v69,84 | 64.16,83 64.7,82.45 64.7,81.7 v60,77 | v37,83 37.18,83 44,89.83 56.91,89.83 62.74,84 v64,84 65.02,85.02 71.22,85.02 73,83.24 v73,68 | v25,65 17,65 12,60 12,9 19,2 44,2 47,5 | v47.02,64.98 47,64.97 v47,58 46,57 v46,52 | 30.98,59.02 30.02,58.05 25.97,58.05 23.62,60.41 23.62,62.12 v27,65.5 28,66.5 28,67 | v28,81 28,67 | v31,53 30.98,53.02 30.98,59.02 | v44,37 56,49 64,49 66.97,46.03 J2.5
  Bottom 0.406: v65,7 54,7 48,13 | v44,37 48,33 v48,14 48,13 | 47,5 48,6 48,13
  Bottom 0.508: S2.1 69.02,2.98 v65,7 | U$10.PIN3 20.82,46.68 J1.5
  Bottom 1.016: 37,35.5 37,20 39.84,17.16 43.84,17.16 v45,16
  pour Bottom: 10,10 10,60 arc-90 50.03,100.03 50.46,100.03 arc-90 90,60.5 90,60 90,10 80,0 20,0
IN1
  Top 0.305: STM32F405RGT6.PB4 42.75,47 42.03,46.28 U$11.IN1
IN2
  Top 0.305: STM32F405RGT6.PB5 43.25,45.16 41.83,43.74 U$11.IN2
IN3
  Top 0.305: STM32F405RGT6.PB6 43.74,47.55 46.13,45.16 46.13,37 44.25,35.12 41.16,35.12 U$11.IN3
IN4
  Top 0.305: U$11.IN4 40.23,33.51 44.51,33.51 47,36 47,45.07 44.25,47.82 STM32F405RGT6.PB7
LED1
  Top 0.305: STM32F405RGT6.PC3 64.01,57.01 70.18,63.18 R13.2
LED2
  Top 0.305: R14.2 34.28,81.28 33,80 26,80 21,75 21,66 22.28,64.72 22.95,64.72 28.15,59.51 STM32F405RGT6.PB12
LED3
  Top 0.305: R15.2 75.91,72.86 80.21,72.86 82.17,70.91 82.17,64.26 80.06,62.15 70.49,62.15 64.85,56.51 STM32F405RGT6.PC2
LED4
  Top 0.305: R16.2 20.71,57.44 32.56,57.44 34.49,55.51 STM32F405RGT6.PA8
LEFT_EMMITER
  Top 0.305: U4.1 40.72,66.14 42.75,64.12 STM32F405RGT6.PC5
LFR
  Top 0.305: U$18.E 23.37,67.56 R9.2 23.37,65.18 28.42,60.13 41.28,60.13 41.75,60.6 STM32F405RGT6.PB1
LR
  Top 0.305: STM32F405RGT6.PB0 42.25,63.9 39.83,66.31 39.83,82.02 R10.2 36.01,85.79 U$17.E
N$1
  Top 0.406: U$14.+ 14.04,72.97 36.78,95.71 63.57,95.71 83.54,75.75 U$13.-
N$2
  Top 1.016: U$6.- 40.38,6.55 U$5.+
N$3
  Top 0.305: R2.1 41.24,62.37 STM32F405RGT6.PB2
N$4
  Top 1.016: U$8.PIN2 26.89,8.65 D1.C
N$5  (via drill 0.85)
  Top 0.305: R7.2 25.88,59.86 v26.01,59.99 | U4.14 42.02,71.02 v42,71
  Bottom 0.305: v26.01,59.99 v26,60 29.74,60 40.74,71 v42,71
N$6
  Top 0.305: C9.1 37.48,62.7 37.73,62.46 39.5,62.46 39.75,62.21 STM32F405RGT6.VCAP_1
N$7
  Top 0.406: R1.1 54.31,60.91 LED1.A
N$8
  Top 0.305: STM32F405RGT6.VCAP_2 36.56,52.51 35.99,51.93 C16.2
N$9
  Top 0.305: R13.1 LED2.A
N$11
  Top 1.016: D1.A 33.77,8.62 U$6.+
N$12
  Top 0.305: EMMI1.- 40.71,87.64 R5.1
N$13
  Top 0.305: R5.2 U4.16
N$14
  Top 1.016: D2.A 41,10.9 U$5.-
N$15
  Top 0.305: R14.1 LED3.A
N$16  (via drill 0.85)
  Top 0.305: R6.2 22.37,61.89 23.26,61 v25,61 | U4.15 41.37,73.37 41,73 v41,72.72
  Bottom 0.305: v25,61 28.45,61 40.02,72.58 40.86,72.58 v41,72.72
N$17
  Top 0.305: R6.1 18.78,61.89 U$14.- 19.61,59.68 R7.1
N$18
  Top 0.305: U4.13 42.67,80.12 49.25,86.7 R8.2
N$19
  Top 0.305: R8.1 55.11,87.44 59.08,87.44 U$15.-
N$22
  Top 0.305: LED4.A 70.87,81.28 R15.1
N$24
  Top 0.305: R27.1 78.27,48.48 | 78.27,48.48 R26.2 | S3.2 79.6,49.2 79.38,49.2 78.67,48.48 78.27,48.48
N$25
  Top 0.305: 18.85,57.29 R16.1
  Top 1.016: LED5.A 18.85,57.29
OUT1
  Top 1.016: J1.1 37.51,37.41 37.51,32.45 39.1,30.85 50.89,30.85 U$11.OUT1
OUT2
  Top 1.016: U$11.OUT2 57.98,36.84 57.98,30.4 57.81,30.4 55.13,27.72 38.8,27.72 35.29,31.22 35.29,36.46 30.81,40.94 19.36,40.94 18.28,42.02 J1.6
OUT3
  Top 1.016: J2.1 77.13,40.9 75.53,39.3 59.54,39.3 57.65,41.2 U$11.OUT3
OUT4
  Top 1.016: U$11.OUT4 64.12,43.74 J2.6
RESET
  Top 0.305: STM32F405RGT6.NRST 65.71,55.01 67.68,56.98 84.33,56.98 87.14,54.17 87.14,44.73 76.57,34.16 S2.2 74.44,7.34 C23.2 72.2,7.28 71.94,7.28 71.76,7.1 71.76,5.67 R24.1
RFR
  Top 0.305: STM32F405RGT6.PA4 45.25,64.25 48.48,67.48 48.48,78.25 49.92,79.69 57.11,79.69 58.98,77.81 65.95,77.81 73.88,69.88 U$12.E R12.2
RIGHT_EMMITER
  Top 0.305: U4.4 42.67,66.52 44.25,64.94 STM32F405RGT6.PA6
RR
  Top 0.305: U$16.E 65.72,88.49 63.44,86.21 | 63.44,86.21 62.27,85.05 54.19,85.05 47.69,78.55 47.69,67.81 44.75,64.87 STM32F405RGT6.PA5 | R11.2 63.44,86.21
RX
  Top 0.305: U$10.PIN7 25.22,56.16 31.71,56.16 33.36,54.51 STM32F405RGT6.PA10
SCL
  Top 0.305: J4.2 38.52,73.05 39.2,72.37 39.2,66.2 39.56,65.85 39.56,63.71 40.75,62.51 STM32F405RGT6.PB10
SCL2
  Top 0.305: J3.2 72.86,52.19 68.18,47.51 46.28,47.51 45.25,48.55 STM32F405RGT6.PB8
SDA
  Top 0.305: J4.1 31.75,75.59 30.34,74.19 30.34,72.22 30.73,71.83 37.63,71.83 38.42,71.05 38.42,66.21 38.85,65.78 38.85,63.76 40.25,62.35 STM32F405RGT6.PB11
SDA2
  Top 0.305: STM32F405RGT6.PB9 45.79,49.97 45.79,49.14 46.84,48.09 66.69,48.09 70.32,51.73 J3.1
SWCLK
  Top 0.305: STM32F405RGT6.PA14 39.25,49.22 39.03,49 24.17,49 22.96,50.2 U$10.PIN2
SWDIO
  Top 0.305: STM32F405RGT6.PA13 37.17,53.01 33.68,53.01 31.21,55.49 25.49,55.49 24.28,54.28 24.28,53.52 23.39,52.63 21.68,52.63 U$10.PIN1
TX
  Top 0.305: STM32F405RGT6.PA9 34.04,55.01 32.24,56.81 23.32,56.81 U$10.PIN8
V_BAT  (via drill 0.55)
  Top 0.305: R3.2 51.8,65.89 C3.2 51.85,67.52 C2.2
  Top 0.406: C2.2 52.68,69.55 52.68,71.94 52.92,72.18 55.32,72.18 56.13,71.38 U3.3
  Top 0.61: U$11.VCC 42.87,41.2 C1.A
  Top 1.016: U3.3 56.13,69.13 v56,69
  Bottom 1.016: U$8.PIN3 20.65,10.65 21.84,11.84 21.84,22.88 U$11.VCC 55.71,56.75 55.71,68.71 v56,69
VA3.3
  Top 0.254: C11.2 53.24,58.28 C12.2 51.3,58.28 51.08,58.06 48.8,58.06 STM32F405RGT6.VDDA
  Top 0.406: C11.2 53.58,58.34 61.52,58.34 L1.2
  Top 0.61: U$18.C 19.6,75.42 31.79,87.62 | L1.2 68.98,65.81 77.27,65.81 80.8,69.31 U$12.C 80.81,70.01 78.94,71.88 73.2,71.88 66.49,78.55 66.49,84.72 U$16.C 68.45,86.69 68.45,88.99 64.33,93.11 36.1,93.11 31.74,88.76 31.79,87.7 31.79,87.62 | U$17.C 31.79,86.47 31.79,87.62
VOL_METER
  Top 0.305: STM32F405RGT6.PA3 46.83,61.51 R3.1 48.1,62.78 R4.2